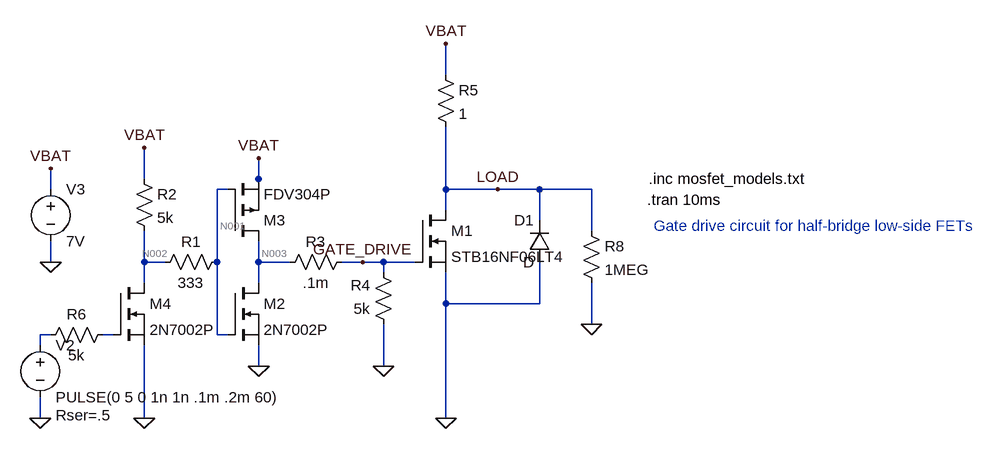
[diagram p0: schematic h_bridge_low_side.asc]
h_bridge_low_side.asc, the LTspice schematic file:
Version 4
SHEET 1 2824 79404
WIRE 256 -80 256 -128
WIRE -208 80 -208 32
WIRE -32 80 -32 48
WIRE -352 96 -352 64
WIRE -80 96 -96 96
WIRE -32 96 -32 80
WIRE 256 96 256 0
WIRE 336 96 256 96
WIRE 400 96 336 96
WIRE 480 96 400 96
WIRE 256 128 256 96
WIRE 400 144 400 96
WIRE 480 160 480 96
WIRE -352 208 -352 176
WIRE -208 208 -208 160
WIRE -176 208 -208 208
WIRE -96 208 -96 96
WIRE -32 208 -32 176
WIRE 16 208 -32 208
WIRE 128 208 96 208
WIRE 160 208 128 208
WIRE 208 208 160 208
WIRE 160 224 160 208
WIRE -208 240 -208 208
WIRE -32 240 -32 208
WIRE 256 272 256 224
WIRE 400 272 400 208
WIRE 400 272 256 272
WIRE 480 304 480 240
WIRE -352 320 -368 320
WIRE -256 320 -272 320
WIRE -96 320 -96 208
WIRE -80 320 -96 320
WIRE -368 336 -368 320
WIRE -32 368 -32 336
WIRE 160 368 160 304
WIRE -368 448 -368 416
WIRE -208 448 -208 336
WIRE 256 448 256 272
FLAG 160 368 0
FLAG -32 368 0
FLAG -32 48 VBAT
FLAG -368 448 0
FLAG -208 448 0
FLAG -208 32 VBAT
FLAG 256 -128 VBAT
FLAG 336 96 LOAD
FLAG 128 208 GATE_DRIVE
FLAG -352 64 VBAT
FLAG -352 208 0
FLAG 256 448 0
FLAG 480 304 0
SYMBOL res 112 192 R90
WINDOW 0 0 56 VBottom 2
WINDOW 3 32 56 VTop 2
SYMATTR InstName R3
SYMATTR Value .1m
SYMBOL res 176 320 R180
WINDOW 0 36 76 Left 2
WINDOW 3 36 40 Left 2
SYMATTR InstName R4
SYMATTR Value 5k
SYMBOL nmos -80 240 R0
SYMATTR InstName M2
SYMATTR Value 2N7002P
SYMATTR Prefix X
SYMBOL res -80 192 R90
WINDOW 0 0 56 VBottom 2
WINDOW 3 32 56 VTop 2
SYMATTR InstName R1
SYMATTR Value 333
SYMBOL nmos -256 240 R0
SYMATTR InstName M4
SYMATTR Value 2N7002P
SYMATTR Prefix X
SYMBOL voltage -368 320 R0
WINDOW 123 0 0 Left 2
WINDOW 39 24 124 Left 2
SYMATTR SpiceLine Rser=.5
SYMATTR InstName V2
SYMATTR Value PULSE(0 5 0 1n 1n .1m .2m 60)
SYMBOL res -224 64 R0
SYMATTR InstName R2
SYMATTR Value 5k
SYMBOL res 240 -96 R0
SYMATTR InstName R5
SYMATTR Value 1
SYMBOL diode 416 208 R180
WINDOW 0 24 64 Left 2
WINDOW 3 24 0 Left 2
SYMATTR InstName D1
SYMBOL res -256 304 R90
WINDOW 0 0 56 VBottom 2
WINDOW 3 32 56 VTop 2
SYMATTR InstName R6
SYMATTR Value 5k
SYMBOL voltage -352 80 R0
WINDOW 123 0 0 Left 2
WINDOW 39 0 0 Left 2
SYMATTR InstName V3
SYMATTR Value 7V
SYMBOL nmos 208 128 R0
SYMATTR InstName M1
SYMATTR Value STB16NF06LT4
SYMATTR Prefix X
SYMBOL res 464 144 R0
SYMATTR InstName R8
SYMATTR Value 1MEG
SYMBOL pmos -80 176 M180
SYMATTR InstName M3
SYMATTR Value FDV304P
SYMATTR Prefix X
TEXT 568 80 Left 2 !.inc mosfet_models.txt
TEXT 566 112 Left 2 !.tran 10ms
TEXT 576 152 Left 2 ;Gate drive circuit for half-bridge low-side FETs

The netlist it stands for:
* h_bridge_low_side.asc
R3 GATE_DRIVE N003 .1m
R4 0 GATE_DRIVE 5k
XM2 N003 N001 0 2N7002P  ; pins D G S
R1 N001 N002 333
XM4 N002 N005 0 2N7002P  ; pins D G S
V2 N004 0 PULSE(0 5 0 1n 1n .1m .2m 60) Rser=.5
R2 VBAT N002 5k
R5 VBAT LOAD 1
D1 0 LOAD D
R6 N005 N004 5k
V3 VBAT 0 7V
XM1 LOAD GATE_DRIVE 0 STB16NF06LT4  ; pins D G S
R8 LOAD 0 1MEG
XM3 N003 N001 VBAT FDV304P  ; pins D G S
.model D D
.lib standard.dio
.inc mosfet_models.txt
.tran 10ms
* Gate drive circuit for half-bridge low-side FETs
.backanno
.end

* Results of the author's LTspice run, read from the files saved beside the schematic
* Operating Point, zero values left out:
*   V(gate_drive) = 896.5 nV
*   V(n003) = 896.5 nV
*   V(n001) = 6.996 V
*   V(n002) = 6.996 V
*   V(vbat) = 7 V
*   V(load) = 7 V
*   I(D1) = -7.01 pA
*   I(R8) = 7 µA
*   I(R5) = 7 µA
*   I(R2) = 705.1 nA
*   I(R1) = -699.2 nA
*   I(R4) = -179.3 pA
*   I(R3) = -172.2 pA
*   I(V3) = -7.734 µA
*   Ix(m2:DRAIN) = 728.3 nA
*   Ix(m2:GATE) = -1.049 nA
*   Ix(m2:SOURCE) = -728.3 nA
*   Ix(m4:DRAIN) = 5.853 nA
*   Ix(m4:SOURCE) = -5.851 nA
*   Ix(m1:1) = 35.53 pA
*   Ix(m1:2) = -7.1 pA
*   Ix(m1:3) = -28.3 pA
*   Ix(m3:20) = -728.4 nA
*   Ix(m3:10) = 700.3 nA
*   Ix(m3:30) = 29.23 nA